# Altium schematic sheet 海关全向控制器主控板电路V2_图传电路.SchDoc
size A4
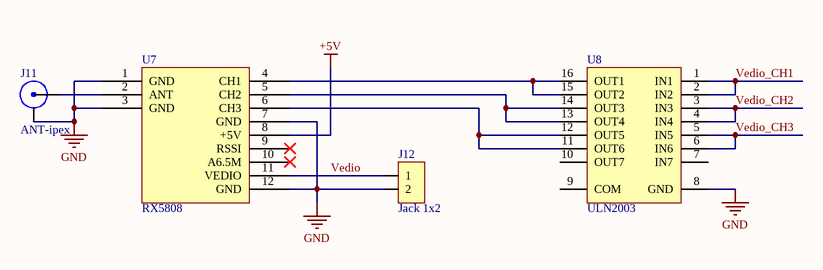
[diagram p0: 海关全向控制器主控板电路V2_图传电路.SchDoc]

## Parts
J11  ANT-ipex  [IPEX]
J12  Jack 1x2  [35363-0260]
U7  RX5808  [RX5808]
U8  ULN2003  [SO16]

## Nets
+5V: U7.8(+5V)
GND: J11.2(GND) J12.2 U7.1(GND) U7.3(GND) U7.7(GND) U7.12(GND) U8.8(GND)
Vedio: J12.1 U7.11(VEDIO)
Vedio_CH1: U8.1(IN1) U8.2(IN2)
Vedio_CH2: U8.3(IN3) U8.4(IN4)
Vedio_CH3: U8.5(IN5) U8.6(IN6)
NetJ11_1: J11.1(ANT) U7.2(ANT)
NetU7_4: U7.4(CH1) U8.15(OUT2) U8.16(OUT1)
NetU7_5: U7.5(CH2) U8.13(OUT4) U8.14(OUT3)
NetU7_6: U7.6(CH3) U8.11(OUT6) U8.12(OUT5)

Not connected (* = marked no-connect by the designer): U7 9(RSSI)* 10(A6.5M)*; U8 7(IN7) 9(COM) 10(OUT7)

## Notes on the sheet
- 文件名:
- 审核:
- 制图人:
- 孟浩
- 校对:
- 图号:
- 批准:
- 日期:

## Library data of the parts
J12 = Jack 1x2: 插座